# Altium schematic sheet sensors.SchDoc
size A
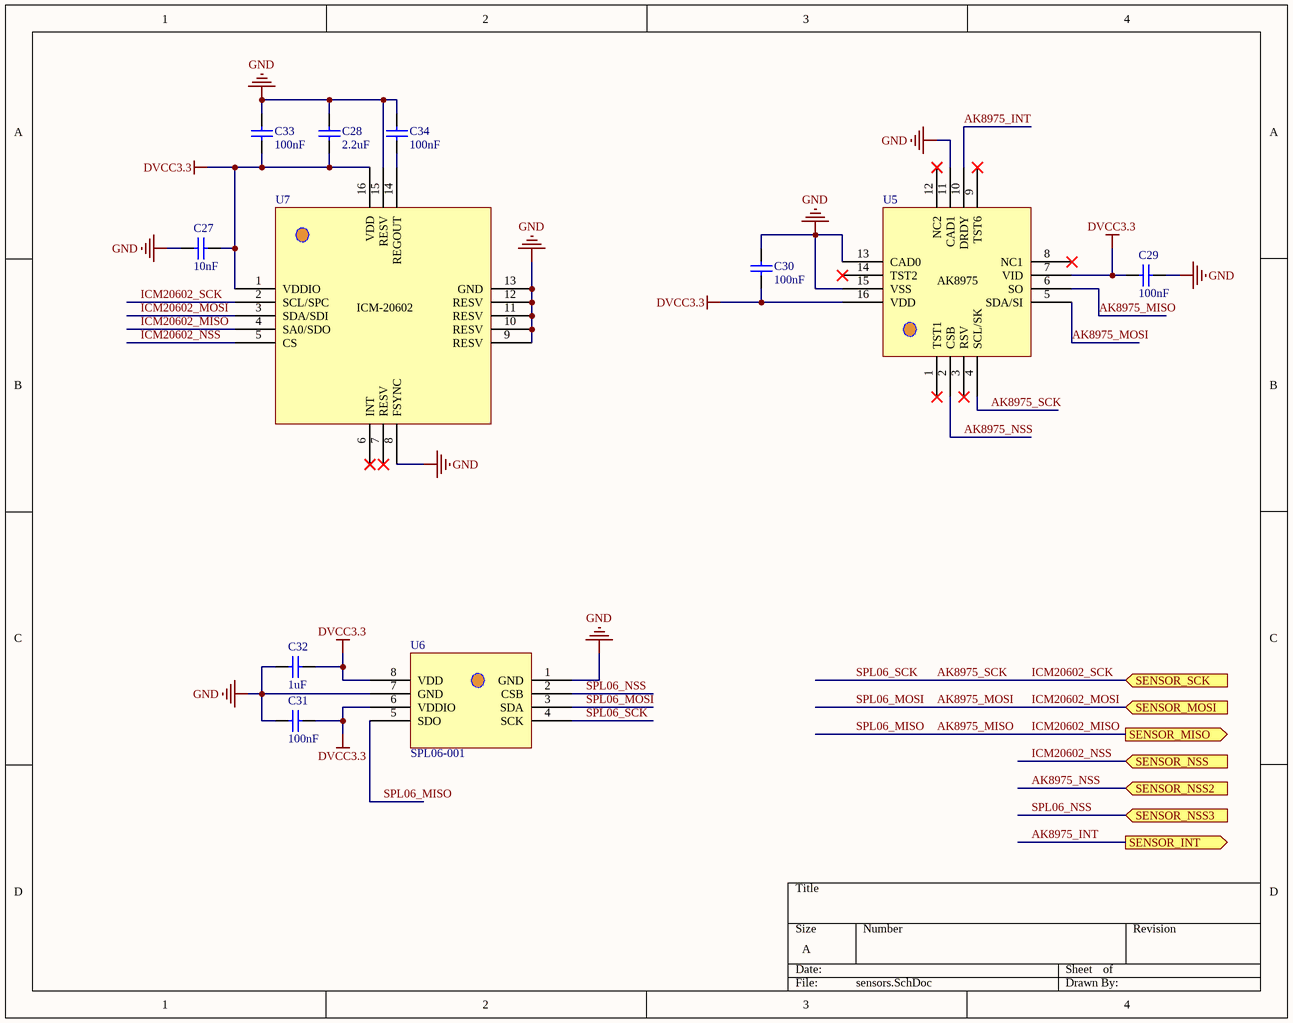
[diagram p0: sensors.SchDoc]

## Parts
C27  10nF  [0603_C]
C28  2.2uF  [0603_C]
C29  100nF  [0603_C]
C30  100nF  [0603_C]
C31  100nF  [0603_C]
C32  1uF  [0603_C]
C33  100nF  [0603_C]
C34  100nF  [0603_C]
U5  AK8975  [AK8975 QFN 16P 400X400X80_HS-17N]  (value not drawn)
U6  SPL06-001  [spl06-001 LGA 8P 4X2_250X200X100]
U7  ICM-20602 6-Axis MEMS  [ICM-20602 LGA]  (value not drawn)

## Ports
SENSOR_INT (out), SENSOR_MISO (out), SENSOR_MOSI (in), SENSOR_NSS2 (in), SENSOR_NSS3 (in), SENSOR_NSS (in), SENSOR_SCK (in)

## Nets
DVCC3.3: C27.2 C28.1 C29.2 C30.2 C31.1 C32.2 C33.1 U5.7(VID) U5.16(VDD) U6.6(VDDIO) U6.8(VDD) U7.1(VDDIO) U7.16(VDD)
GND: C27.1 C28.2 C29.1 C30.1 C31.2 C32.1 C33.2 C34.2 U5.11(CAD1) U5.13(CAD0) U5.15(VSS) U6.1(GND) U6.7(GND) U7.8(FSYNC) U7.9(RESV) U7.10(RESV) U7.11(RESV) U7.12(RESV) U7.13(GND) U7.15(RESV)
AK8975_INT: U5.10(DRDY) ; port SENSOR_INT
AK8975_MISO: U5.6(SO) U6.5(SDO) U7.4(SA0/SDO) ; port SENSOR_MISO  [also labelled ICM20602_MISO, SPL06_MISO]
AK8975_MOSI: U5.5(SDA/SI) U6.3(SDA) U7.3(SDA/SDI) ; port SENSOR_MOSI  [also labelled ICM20602_MOSI, SPL06_MOSI]
AK8975_NSS: U5.2(CSB) ; port SENSOR_NSS2
AK8975_SCK: U5.4(SCL/SK) U6.4(SCK) U7.2(SCL/SPC) ; port SENSOR_SCK  [also labelled ICM20602_SCK, SPL06_SCK]
ICM20602_NSS: U7.5(CS) ; port SENSOR_NSS
SPL06_NSS: U6.2(CSB) ; port SENSOR_NSS3
NetC34_1: C34.1 U7.14(REGOUT)

Not connected (* = marked no-connect by the designer): U5 1(TST1)* 3(RSV)* 8(NC1)* 9(TST6)* 12(NC2)* 14(TST2)*; U7 6(INT)* 7(RESV)*

## Library data of the parts
C27 = 0603 10nF (103) 10% 50V: 贴片电容; ComponentLink1Description: 供应商链接; ComponentLink1URL: http://www.szlcsc.com/product/details_58143.html; Package: 0603; Supplier: LC; SuppliersPartNumber: C57112
C28 = 0603 2.2uF (225) 10% 16V: 贴片电容; ComponentLink1Description: 供应商链接; ComponentLink1URL: http://www.szlcsc.com/product/details_24366.html; Package: 0603; Supplier: LC; SuppliersPartNumber: C23630
C29-C31 C33 C34 = 0603 100nF (104) 10% 50V: 贴片电容; ComponentLink1Description: 供应商链接; ComponentLink1URL: http://www.szlcsc.com/product/details_15331.html; Package: 0603; Supplier: LC; SuppliersPartNumber: C14663
C32 = 0603 1uF (105) 10% 50V: 贴片电容; ComponentLink1Description: 供应商链接; ComponentLink1URL: http://www.szlcsc.com/product/details_16531.html; Package: 0603; Supplier: LC; SuppliersPartNumber: C15849
U7 = ICM-20602: High Performance 6-Axis MEMS MotionTracking Device